# Altium schematic sheet ethernet-v3v3.SchDoc
size A
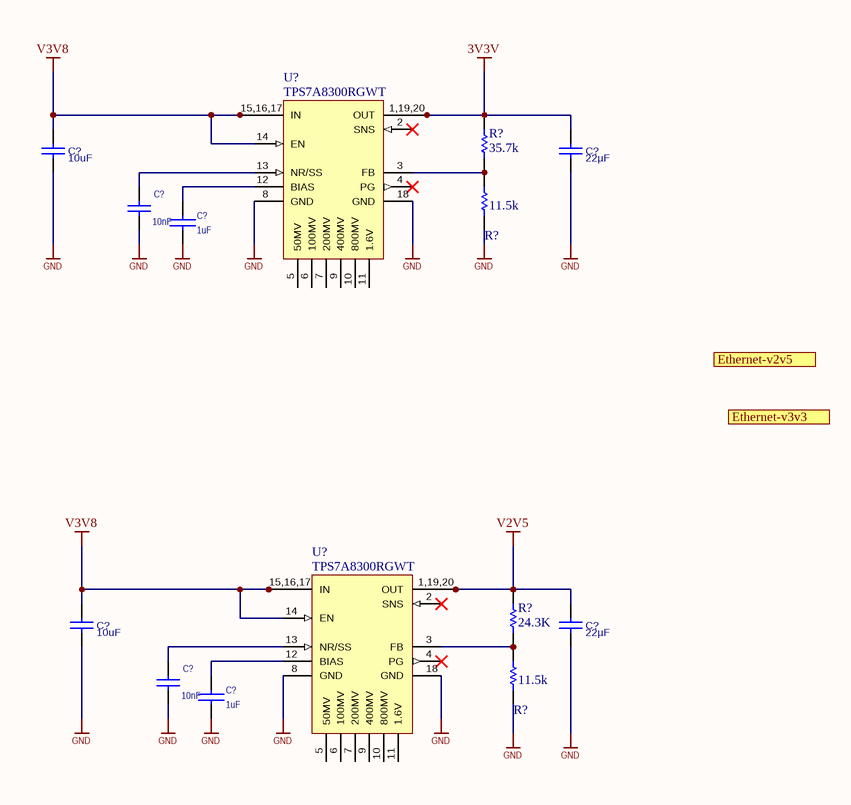
[diagram p0: ethernet-v3v3.SchDoc]

## Parts
(Parts that share a designator on the sheet are numbered #1, #2 ... from top to bottom, then left to right.)
C?#1  value 10uF  [CAPC160X80X90L20N]  (hidden comment: LMK212B7106KG)
C?#2  value 22µF  [CAPC160X80X90L20N]  (hidden comment: CC0805MKX5R8BB226)
C?#3  value 10nF  [CAPC100X50X55L25N]  (hidden comment: GRM155R71H103KA88)
C?#4  value 1uF  [CAPC100X50X55L25N]  (hidden comment: GRM155R61A105KE15D)
C?#5  value 10uF  [CAPC160X80X90L20N]  (hidden comment: LMK212B7106KG)
C?#6  value 22µF  [CAPC160X80X90L20N]  (hidden comment: CC0805MKX5R8BB226)
C?#7  value 10nF  [CAPC100X50X55L25N]  (hidden comment: GRM155R71H103KA88)
C?#8  value 1uF  [CAPC100X50X55L25N]  (hidden comment: GRM155R61A105KE15D)
R?#1  value 35.7k  [0603]  (hidden comment: RC0603FR-073K57L)
R?#2  value 11.5k  [0603]  (hidden comment: RT0603BRE0711K5L)
R?#3  value 24.3K  [0603]  (hidden comment: RT0603BRE0724K3L)
R?#4  value 11.5k  [0603]  (hidden comment: RT0603BRE0711K5L)
U?#1  TPS7A8300RGWT  [QFN65P500X500X100-21N]
U?#2  TPS7A8300RGWT  [QFN65P500X500X100-21N]

## Ports
Ethernet-v2v5, Ethernet-v3v3

## Nets
3V3V: C?#2.1 R?#1.2 U?#1.1(OUT) U?#1.19(OUT) U?#1.20(OUT)
GND: C?#1.2 C?#2.2 C?#3.1 C?#4.1 C?#5.2 C?#6.2 C?#7.1 C?#8.1 R?#2.1 R?#4.1 U?#1.8(GND) U?#1.18(GND) U?#2.8(GND) U?#2.18(GND)
V2V5: C?#6.1 R?#3.2 U?#2.1(OUT) U?#2.19(OUT) U?#2.20(OUT)
V3V8: C?#1.1 C?#5.1 U?#1.14(EN) U?#1.15(IN) U?#1.16(IN) U?#1.17(IN) U?#2.14(EN) U?#2.15(IN) U?#2.16(IN) U?#2.17(IN)
NetC?#3_2: C?#3.2 U?#1.13(NR/SS)
NetC?#4_2: C?#4.2 U?#1.12(BIAS)
NetC?#7_2: C?#7.2 U?#2.13(NR/SS)
NetC?#8_2: C?#8.2 U?#2.12(BIAS)
NetR?#1_1: R?#1.1 R?#2.2 U?#1.3(FB)
NetR?#3_1: R?#3.1 R?#4.2 U?#2.3(FB)

Not connected (* = marked no-connect by the designer): U?#1 2(SNS)* 4(PG)* 5(50MV) 6(100MV) 7(200MV) 9(400MV) 10(800MV) 11(1.6V); U?#2 2(SNS)* 4(PG)* 5(50MV) 6(100MV) 7(200MV) 9(400MV) 10(800MV) 11(1.6V)

## Notes on the sheet
- (in symbol TPS7A8300RGWT) 15,16,17; 1,19,20

## Library data of the parts
C?#1 C?#5 = LMK212B7106KG: Ceramic Capacitor 10uF ±10% 10V X7R 0805; Manufacturer: Taiyo Yuden; pF: 10000000; Manufacturer P/N: LMK212B7106KG; Tolerance: ±10%; Tr: *; Package: 0805; Voltage: 10V
C?#2 C?#6 = LMK212B7106KG: CAP CER 22UF 25V X5R 0805; Manufacturer: Yageo; Tolerance: ±20%; Tr: 55°C ~ 85°C; Manufacturer P/N: CC0805MKX5R8BB226; Package: 0805; Voltage: 25V
C?#3 C?#7 = CAP 0402: Ceramic Capacitor 10nF ±10% 50V X7R 0402; Manufacturer: Murata; Tr: -55:125; Voltage: 50V; Manufacturer P/N: GRM155R71H103KA88; Package: 0402; Tolerance: ±10%
C?#4 C?#8 = CAP: Ceramic Capacitor 1uF ±10% 10V X5R 0402; Manufacturer: Murata; Tr: -55:125; Manufacturer P/N: GRM155R61A105KE15D; Package: 0402; Tolerance: ±10%; Voltage: 10V
R?#1 = RES 0603: Resistor, SMD 0603,RC0603JR-0710KL,Yageo AmericaRC0603FR-073K57L; Manufacturer: Yageo; Manufacturer P/N: RC0603FR-073K57L; PCB Package: 0603; Do Not Place: *
R?#2 = RES 0603: RES SMD 11.5KOHM 0.1% 1/10W 0603, RT0603BRE0711K5L, Yageo; Manufacturer: Yageo; Manufacturer P/N: RT0603BRE0711K5L; PCB Package: 0603; Do Not Place: *
R?#3 = RES 0603: RES SMD 24.3KOHM 0.1% 1/10W 0603,RT0603BRE0724K3L, Yageo; Manufacturer: Yageo; Manufacturer P/N: RT0603BRE0724K3L; PCB Package: 0603; Do Not Place: *
R?#4 = RES 0603: RES SMD 11.5KOHM 0.1% 1/10W 0603,Yageo America ,RT0603BRE0711K5L; Manufacturer: Yageo; Manufacturer P/N: RT0603BRE0711K5L; PCB Package: 0603; Do Not Place: *
U?#1 U?#2 = TPS7A8300RGWT: 2A, Low-Dropout Voltage Regulator for High Speed Communication Systems 20-VQFN -40 to 125; MF: Texas Instruments; SnapEDA_Link: https://www.snapeda.com/symbols-footprints/TPS7A8300RGWT/Texas%20Instruments/view-part/?ref=snap; Availability: Good; Package: VQFN-20 Texas Instruments; Price: 4.36 USD; MP: TPS7A8300RGWT; Value: *